# Altium project Siron_screen.PrjPcb
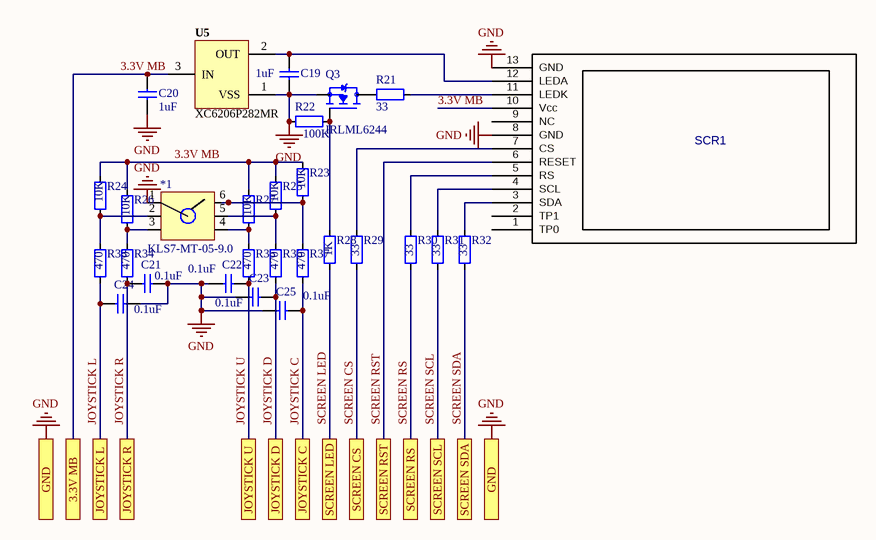
[diagram p0: Screen_PCB.SchDoc]
1 sheet, 28 parts. Net scope: flat (ports and power ports of the same name join across sheets).
Board file: Screen_PCB.PcbDoc

## Sheet Screen_PCB.SchDoc
size A2; Organization: Altium Limited; Address1: L3, 12a Rodborough Rd; Address2: Frenchs Forest; Address3: NSW; Address4: Australia 2086

### Parts
*1  KLS7-MT-05-9.0  [KLS7-MT-05-9.0]
C19  1uF  [C0805]
C20  1uF  [C0805]
C21  0.1uF  [R0603]
C22  0.1uF  [R0603]
C23  0.1uF  [R0603]
C24  0.1uF  [R0603]
C25  0.1uF  [R0603]
Q3  IRLML6244  [SOT95P237X112-3N]
R21  33  [R0603]
R22  100K  [R0603]
R23  10K  [R0603]
R24  10K  [R0603]
R25  10K  [R0603]
R26  10K  [R0603]
R27  10K  [R0603]
R28  1K  [R0603]
R29  33  [R0603]
R30  33  [R0603]
R31  33  [R0603]
R32  33  [R0603]
R33  470  [R0603]
R34  470  [R0603]
R35  470  [R0603]
R36  470  [R0603]
R37  470  [R0603]
SCR1  0.96INCH_TFT  [0.96INCH_TFT]  (value not drawn)
U5  XC6206P282MR  [SOT95P237X112-3N]

### Ports
3.3V MB, GND, JOYSTICK C, JOYSTICK D, JOYSTICK L, JOYSTICK R, JOYSTICK U, SCREEN CS, SCREEN LED, SCREEN RS, SCREEN RST, SCREEN SCL, SCREEN SDA

### Nets
GND: *1.1 C19.1 C20.1 C21.1 C22.2 C23.2 C24.1 C25.2 Q3.2(S) R22.1 SCR1.8(GND) SCR1.13(GND) U5.1(VSS) ; port GND
3.3V MB: C20.2 R23.1 R24.1 R25.1 R26.1 R27.1 SCR1.10(Vcc) U5.3(IN) ; port 3.3V MB
JOYSTICK C: C25.1 R37.2 ; port JOYSTICK C
JOYSTICK D: C23.1 R36.2 ; port JOYSTICK D
JOYSTICK L: C24.2 R33.2 ; port JOYSTICK L
JOYSTICK R: C21.2 R34.2 ; port JOYSTICK R
JOYSTICK U: C22.1 R35.2 ; port JOYSTICK U
SCREEN CS: R29.2 ; port SCREEN CS
SCREEN LED: R28.2 ; port SCREEN LED
SCREEN RS: R30.2 ; port SCREEN RS
SCREEN RST: SCR1.6(RESET) ; port SCREEN RST
SCREEN SCL: R31.2 ; port SCREEN SCL
SCREEN SDA: R32.2 ; port SCREEN SDA
Net*1_2: *1.2 R24.2 R33.1
Net*1_3: *1.3 R26.2 R34.1
Net*1_4: *1.4 R27.2 R35.1
Net*1_5: *1.5 R25.2 R36.1
Net*1_6: *1.6 R23.2 R37.1
NetC19_2: C19.2 SCR1.12(LEDA) U5.2(OUT)
NetQ3_1: Q3.1(G) R22.2 R28.1
NetQ3_3: Q3.3(D) R21.2
NetR21_1: R21.1 SCR1.11(LEDK)
NetR29_1: R29.1 SCR1.7(CS)
NetR30_1: R30.1 SCR1.5(RS)
NetR31_1: R31.1 SCR1.4(SCL)
NetR32_1: R32.1 SCR1.3(SDA)

Not connected (* = marked no-connect by the designer): SCR1 1(TP0) 2(TP1) 9(NC)

### Notes on the sheet
- Title
- Size:
- Date:
- File:
- A2
- Number:
- Time:
- Revision:
- Sheet
- of

### Library data of the parts
C19-C25 = CAP
  C19 C20: Value: 1uF
  C21-C25: Value: 0.1uF
Q3 = IRLML6244: MOSFET P-CH 30V 3.6A SOT-23-3; MF: {'manufacturer': u'Infineon Technologies'}; MP: IRLML9301TRPBF; Package: None; Price: None; Value: *; Availability: Unavailable
R21-R37 = RES SMD UNI: Resistor SMD; Category: Resistors
  R21 R29-R32: Value: 33
  R22: Value: 100K
  R23-R27: Value: 10K
  R28: Value: 1K
  R33-R37: Value: 470
SCR1 = 0.96INCH_TFT: LH096T-IG01 TFT RGB 0,96" screen; Value: *
U5 = XC6206P282MR: Adjustable Precision Shunt Regulator, 34 ppm / degC, 200 mA, -40 to 85 degC, 3-pin SOT-23 (DBZ), Green (RoHS & no Sb/Br); Manufacturer: UTD; VO Adj(Max)(V): 36; VO Adj(Min)(V): 2.495; Temp Coeff(Max)(ppm/ degree C): 92; Iout/Iz(Max)(mA): 100; Temp Coeff(Typ)(ppm/ degree C): 34; Rating: Military; Initial Accuracy @ 25/deg C(%): 2; SubFamily: Shunt Voltage Reference; Min Iz for Regulation(uA): 600; Eco-Plan: Green (RoHS & no Sb/Br); ComponentLink3URL: http://www.ti.com/litv/pdf/mpds108a; ComponentLink3Description: Package Specification; ComponentLink1Description: Manufacturer URL; Code_JEDEC: TO-236; PartNumber: XC6206P282MR; PackageReference: DBZ0003A; ComponentLink1URL: http://www.ti.com/; ComponentLink2URL: http://www.ti.com/general/docs/lit/getliterature.tsp?genericPartNumber=TL431&fileType=pdf; DatasheetVersion: SLVS543M; ComponentLink2Description: Datasheet; PackageVersion: 4203227/B; Mounting Technology: Surface Mount; PackageDescription: 3-Pin Plastic Small Outline, Body 2.92 x 1.3 mm, Pitch 0.95 mm